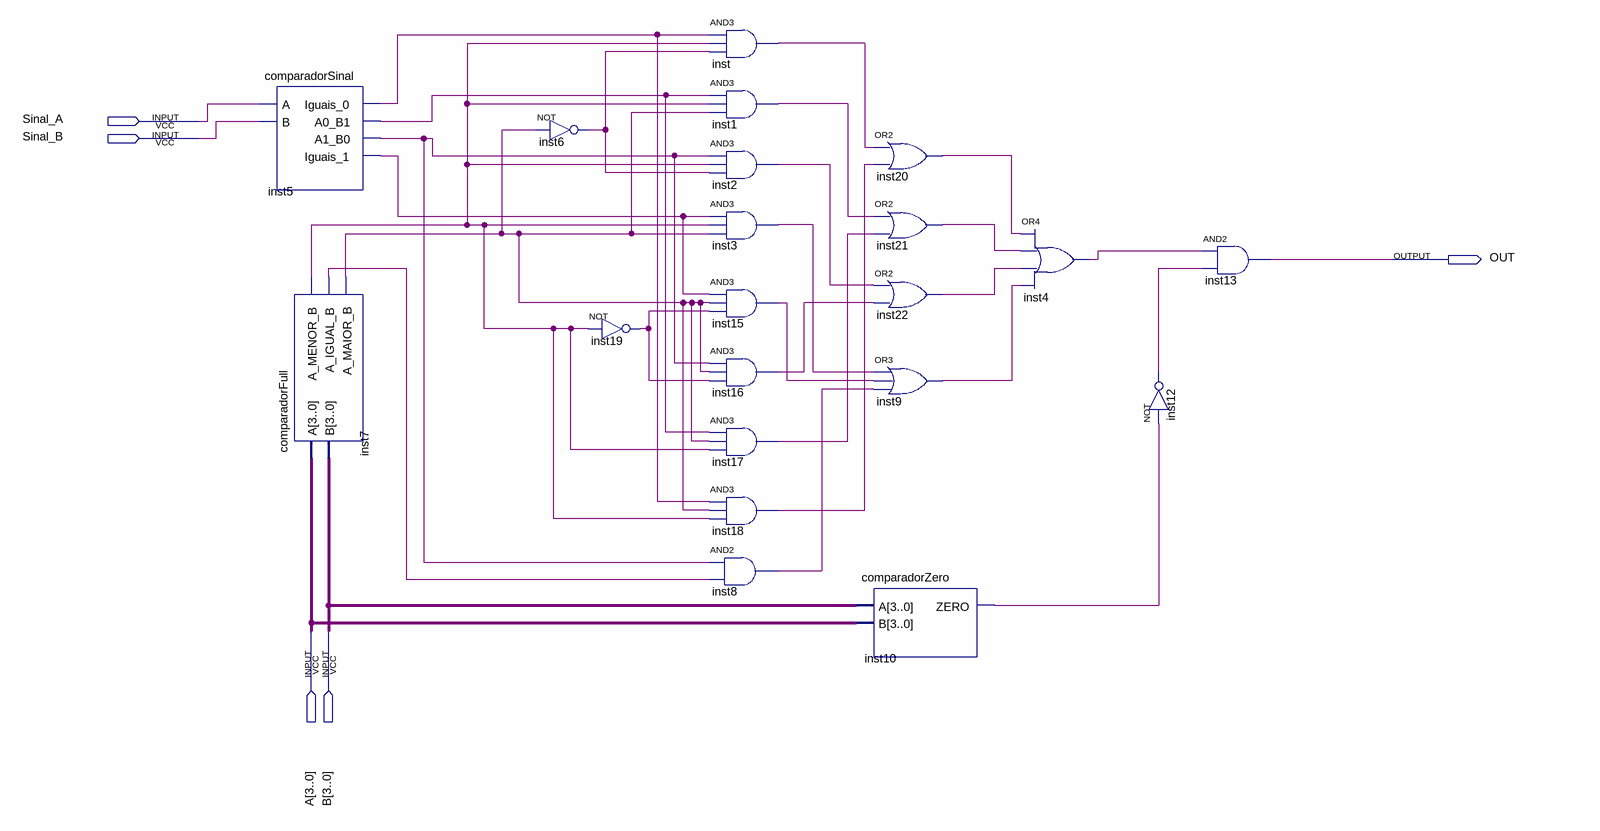
[diagram p0: schematic sheet]
// Quartus schematic comparadorMenor.bdf as structural Verilog: 21 symbols, 5 pins
module comparadorMenor (
  input  Sinal_A,
  input  Sinal_B,
  input  [3:0] A,
  input  [3:0] B,
  output OUT
);

  wire inst1_out, inst2_out, inst3_out, inst4_out, inst5_a0_b1, inst5_a1_b0, inst5_iguais_0, inst5_iguais_1,
       inst6_out, inst7_a_igual_b, inst7_a_maior_b, inst7_a_menor_b, inst8_out, inst9_out, inst10_zero,
       inst12_out, inst15_out, inst16_out, inst17_out, inst18_out, inst19_out, inst20_out, inst21_out,
       inst22_out, inst_out;

  comparadorSinal inst5 (
    .A(Sinal_A), .B(Sinal_B), .Iguais_0(inst5_iguais_0), .A0_B1(inst5_a0_b1), .A1_B0(inst5_a1_b0),
    .Iguais_1(inst5_iguais_1));
  comparadorFull inst7 (
    .A(A), .B(B), .A_MENOR_B(inst7_a_menor_b), .A_IGUAL_B(inst7_a_igual_b), .A_MAIOR_B(inst7_a_maior_b));
  not inst6 (inst6_out, inst7_a_maior_b);
  not inst19 (inst19_out, inst7_a_menor_b);
  and inst (inst_out, inst5_iguais_0, inst7_a_menor_b, inst6_out);
  and inst1 (inst1_out, inst5_a0_b1, inst7_a_menor_b, inst7_a_maior_b);
  and inst2 (inst2_out, inst5_a1_b0, inst7_a_menor_b, inst6_out);
  and inst3 (inst3_out, inst5_iguais_1, inst7_a_menor_b, inst7_a_maior_b);
  and inst15 (inst15_out, inst5_iguais_1, inst7_a_maior_b, inst19_out);
  and inst16 (inst16_out, inst5_a1_b0, inst7_a_maior_b, inst19_out);
  and inst17 (inst17_out, inst5_a0_b1, inst7_a_maior_b, inst7_a_menor_b);
  and inst18 (inst18_out, inst5_iguais_0, inst7_a_maior_b, inst7_a_menor_b);
  and inst8 (inst8_out, inst5_a1_b0, inst7_a_igual_b);
  or inst20 (inst20_out, inst_out, inst18_out);
  or inst21 (inst21_out, inst1_out, inst17_out);
  or inst22 (inst22_out, inst2_out, inst16_out);
  or inst9 (inst9_out, inst3_out, inst15_out, inst8_out);
  comparadorZero inst10 (.A(B), .B(A), .ZERO(inst10_zero));
  or inst4 (inst4_out, inst20_out, inst21_out, inst22_out, inst9_out);
  not inst12 (inst12_out, inst10_zero);
  and inst13 (OUT, inst4_out, inst12_out);
endmodule
